# Altium schematic sheet Peripherals_Main_Board.SchDoc
size A3; Organization: Altium Limited; Address1: L3, 12a Rodborough Rd; Address2: Frenchs Forest; Address3: NSW; Address4: Australia 2086; DocumentNumber: 4; SheetNumber: 4; SheetTotal: 8
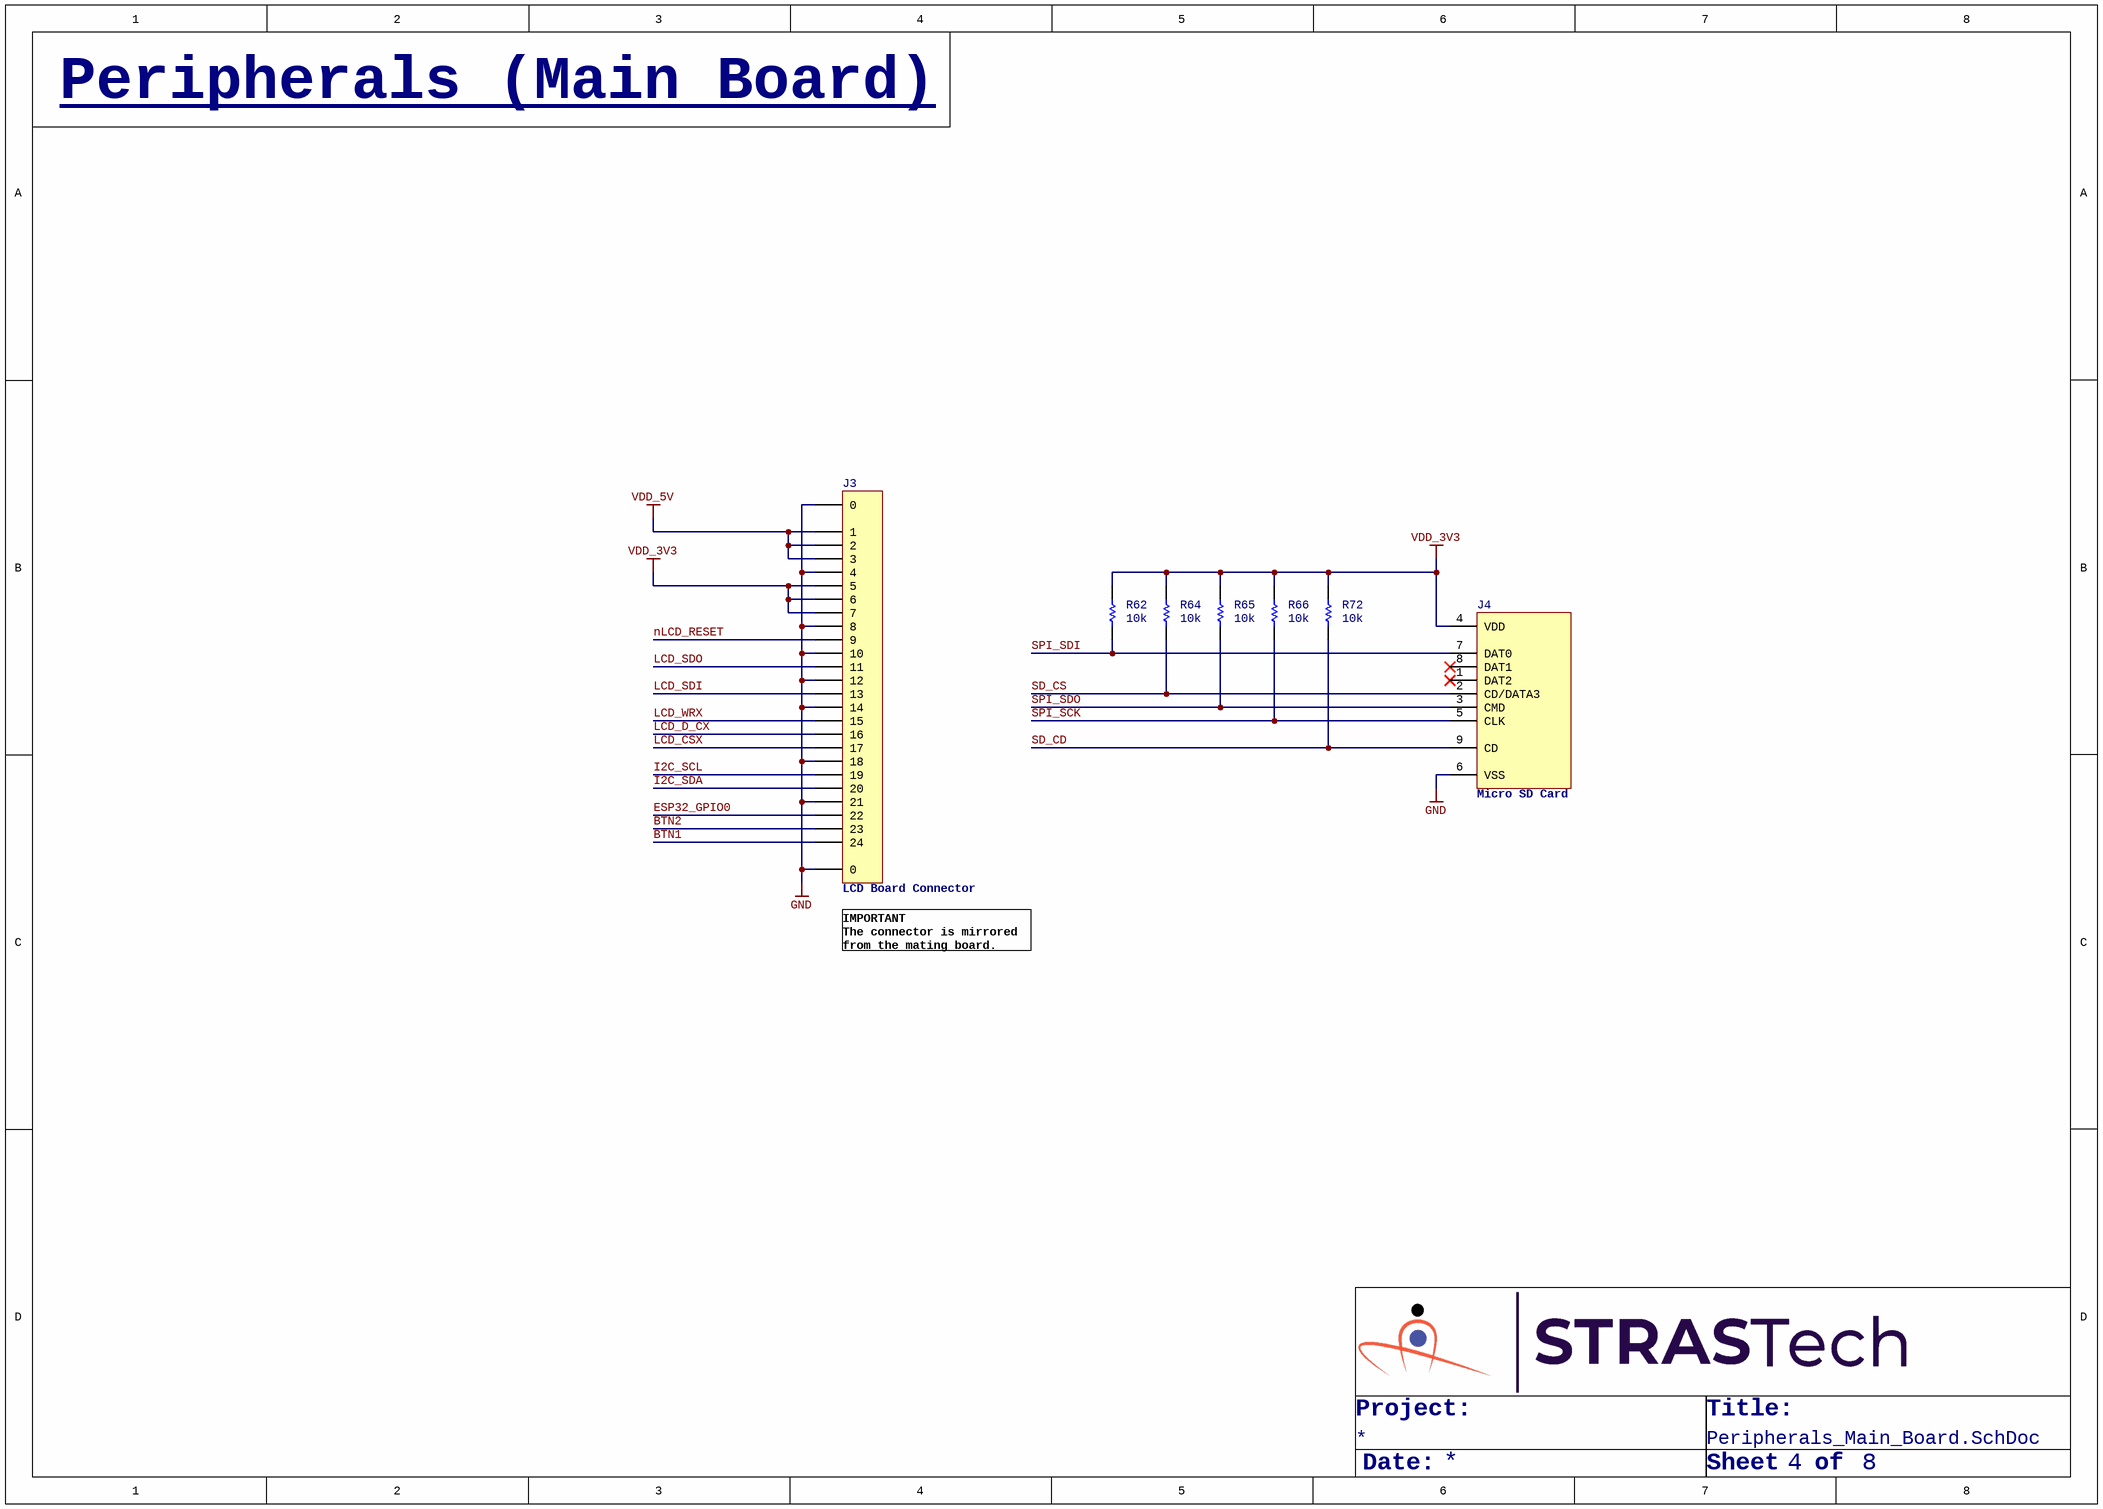
[diagram p0: Peripherals_Main_Board.SchDoc]

## Parts
J3  Conn,FFC,Bottom,24 Pin,0.5mm  [Conn,FFC,Bottom,24Pos,0.5mm]  (value not drawn)
J4  Micro SD Card  [Conn,MicroSD,Push-Push,SMD]  (value not drawn)
R62  10k  [RES,0402]
R64  10k  [RES,0402]
R65  10k  [RES,0402]
R66  10k  [RES,0402]
R72  10k  [RES,0402]

## Nets
GND: J3.0 J3.4 J3.8 J3.10 J3.12 J3.14 J3.18 J3.21 J4.6(VSS)
VDD_3V3: J3.5 J3.6 J3.7 J4.4(VDD) R62.2 R64.2 R65.2 R66.2 R72.2
VDD_5V: J3.1 J3.2 J3.3
BTN1: J3.24
BTN2: J3.23
ESP32_GPIO0: J3.22
I2C_SCL: J3.19
I2C_SDA: J3.20
LCD_CSX: J3.17
LCD_D_CX: J3.16
LCD_SDI: J3.13
LCD_SDO: J3.11
LCD_WRX: J3.15
nLCD_RESET: J3.9
SD_CD: J4.9(CD) R72.1
SD_CS: J4.2(CD/DATA3) R64.1
SPI_SCK: J4.5(CLK) R66.1
SPI_SDI: J4.7(DAT0) R62.1
SPI_SDO: J4.3(CMD) R65.1

Not connected (* = marked no-connect by the designer): J4 1(DAT2)* 8(DAT1)*

## Notes on the sheet
- Peripherals (Main Board)
- (near J4) Micro SD Card
- (near J3) LCD Board Connector
- (near J3) IMPORTANT
  The connector is mirrored from the mating board.
- Project:
- Title:
- Date:
- Sheet
- of
- Title
- Size:
- A3
- Revision:
- Design By:

## Library data of the parts
J3 = Conn,FFC,Bottom,24 Pin,0.5mm: 24 Position FFC, FPC Connector Contacts, Bottom 0.020" (0.50mm) Surface Mount, Right Angle; Vendor Part Number: 2057-PCA-6-LA-24-HL-3-ND; Manufacturer: Adam Tech; Manufacturer Part Number: PCA-6-LA-24-HL-3; Vendor: Digikey; HelpURL: https://app.adam-tech.com/products/download/data_sheet/198704/pca-6-la-xx-hl-3-data-sheet.pdf; Created By: Judd Foster
J4 = Conn,MicroSD,SMD,Push-Push: 9 (8 + 1) Position Card Connector Secure Digital - microSD™ Surface Mount, Right Angle Gold; Manufacturer: GCT; Manufacturer Part Number: MEM2075-00-140-01-A; Vendor Part Number: 2073-MEM2075-00-140-01-ACT-ND; Vendor: Digikey; CreatedBy: Judd Foster; HelpURL: https://gct.co/files/specs/MEM2075-SPEC.pdf
R62 R64-R66 R72 = RES,10k,5%,0.063W,0402: 10 kOhms ±5% 0.063W, 1/16W Chip Resistor 0402 (1005 Metric) Automotive AEC-Q200 Thick Film; Vendor Part Number: RMCF0402JT10K0CT-ND; Manufacturer: Stackpole Electronics Inc; Manufacturer Part Number: RMCF0402JT10K0; Vendor: DIgikey; HelpURL: https://www.seielect.com/catalog/sei-rmcf_rmcp.pdf; CreatedBy: Judd Foster